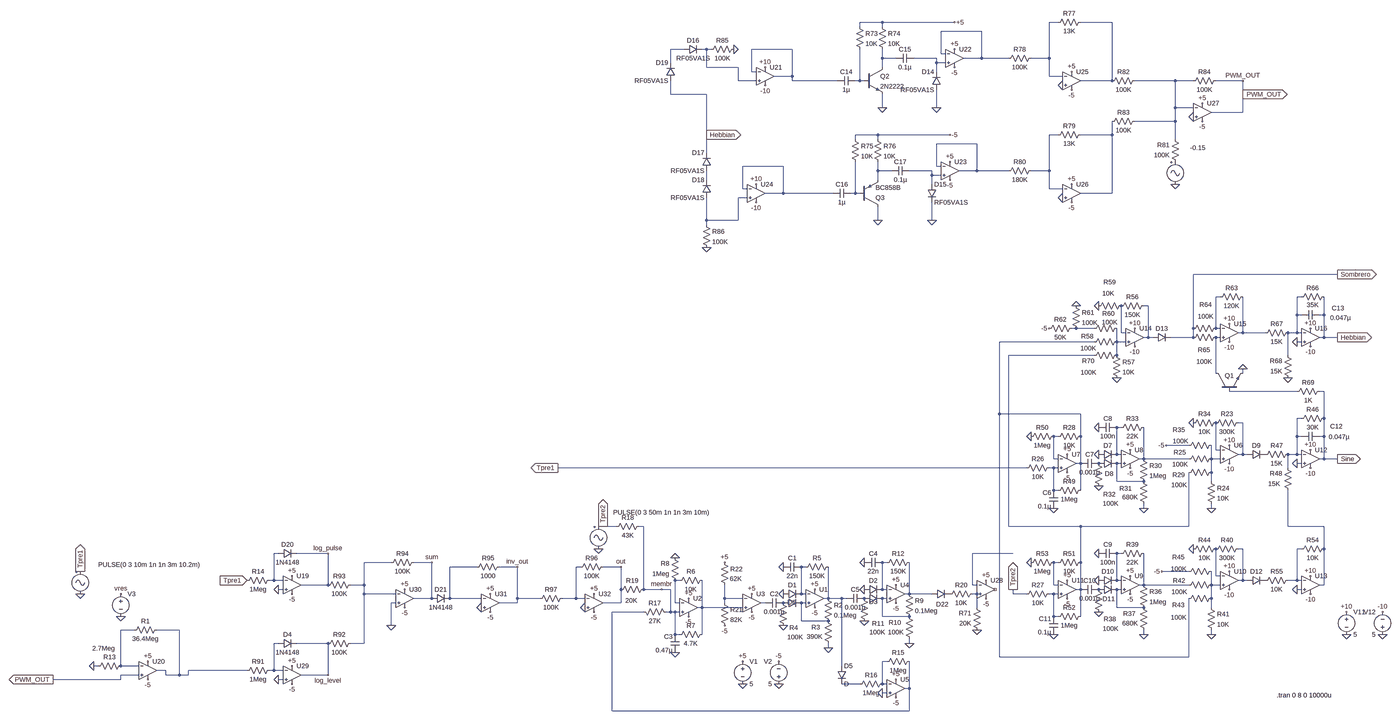
[diagram p0: schematic Lastest_stable-2.asc, whole sheet]
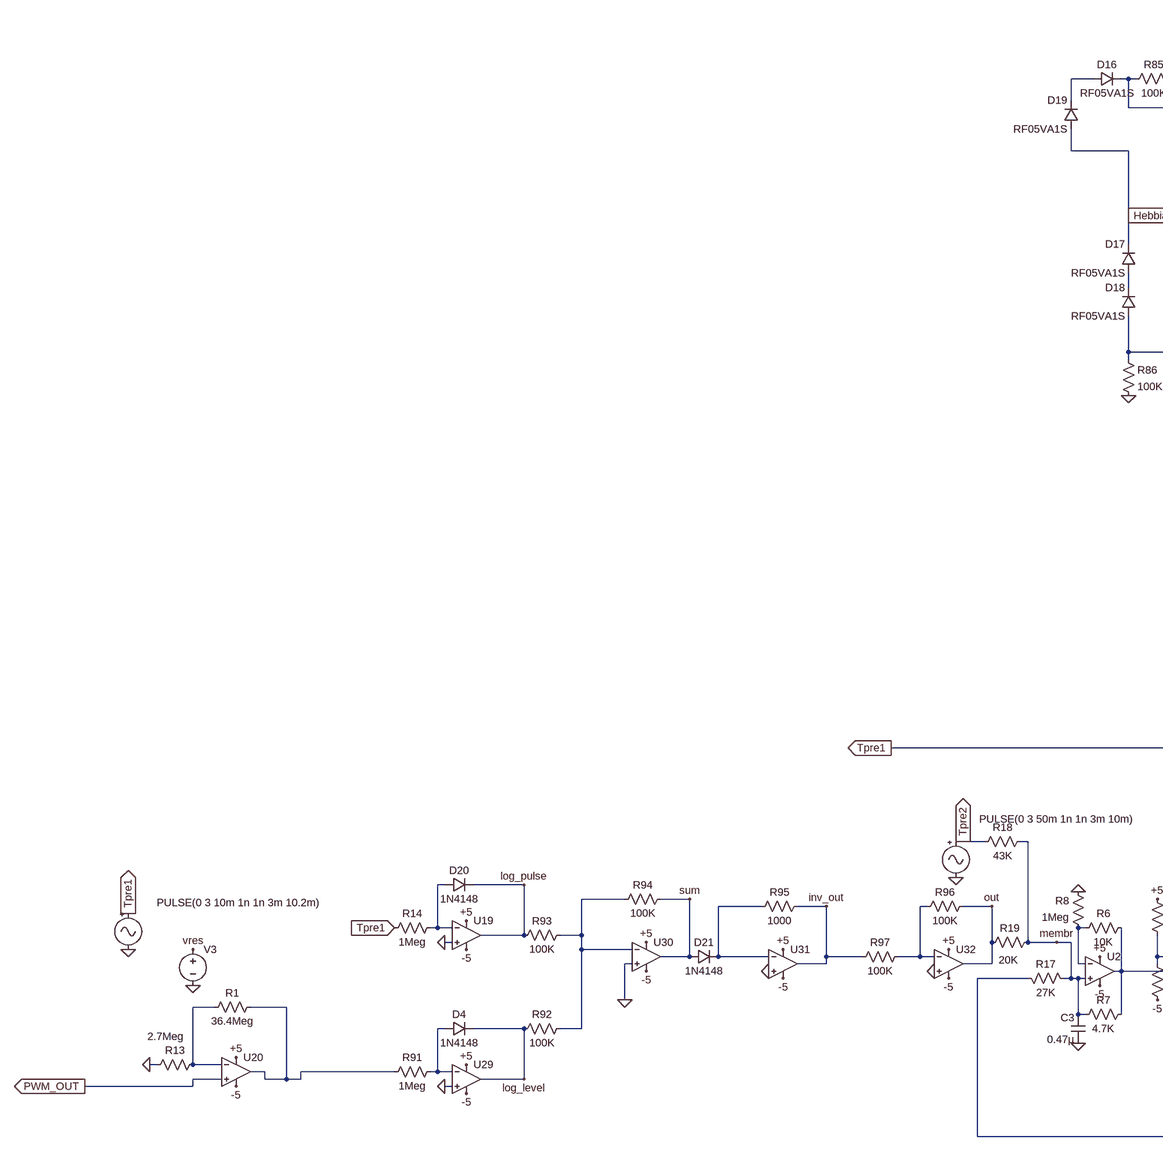
[diagram p1: schematic Lastest_stable-2.asc, part, row 1 of 1, column 1 of 2]
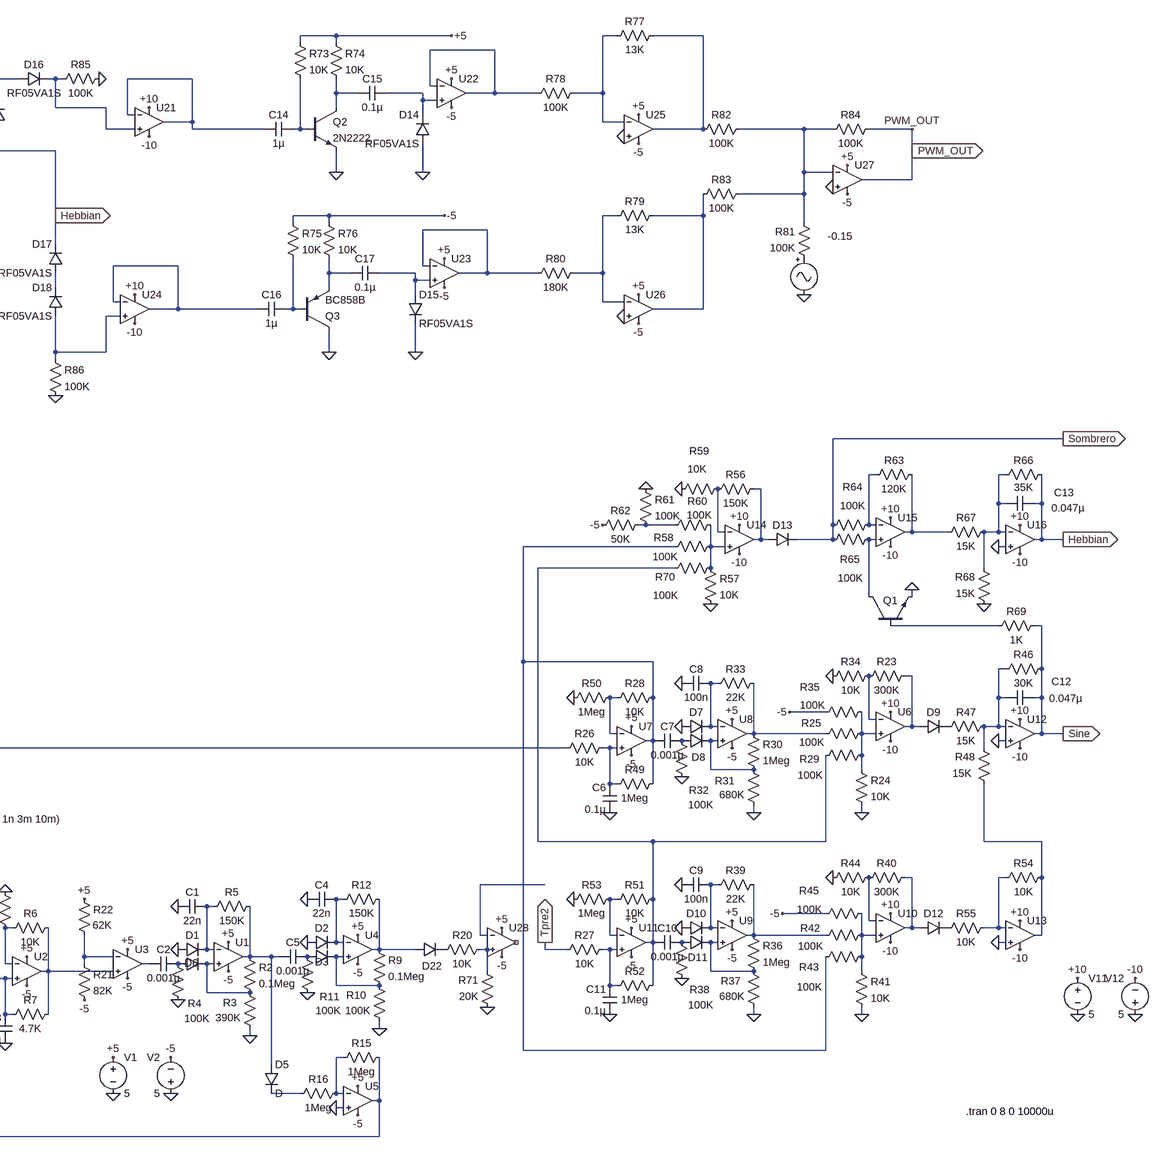
[diagram p2: schematic Lastest_stable-2.asc, part, row 1 of 1, column 2 of 2]
Lastest_stable-2.asc, the LTspice schematic file:
Version 4
SHEET 1 3300 772
WIRE 1488 -1728 1408 -1728
WIRE 1744 -1728 1488 -1728
WIRE 2112 -1728 2080 -1728
WIRE 2304 -1728 2192 -1728
WIRE 1408 -1712 1408 -1728
WIRE 1488 -1712 1488 -1728
WIRE 1840 -1696 1696 -1696
WIRE 784 -1632 736 -1632
WIRE 864 -1632 848 -1632
WIRE 880 -1632 864 -1632
WIRE 1168 -1632 1024 -1632
WIRE 1696 -1616 1696 -1696
WIRE 1712 -1616 1696 -1616
WIRE 1488 -1600 1488 -1632
WIRE 1536 -1600 1488 -1600
WIRE 1680 -1600 1600 -1600
WIRE 1840 -1600 1840 -1696
WIRE 1840 -1600 1776 -1600
WIRE 1936 -1600 1840 -1600
WIRE 2080 -1600 2080 -1728
WIRE 2080 -1600 2016 -1600
WIRE 736 -1584 736 -1632
WIRE 1680 -1584 1680 -1600
WIRE 1712 -1584 1680 -1584
WIRE 864 -1568 864 -1632
WIRE 976 -1568 864 -1568
WIRE 1488 -1568 1488 -1600
WIRE 1024 -1552 1024 -1632
WIRE 1040 -1552 1024 -1552
WIRE 1680 -1552 1680 -1584
WIRE 1168 -1536 1168 -1632
WIRE 1168 -1536 1104 -1536
WIRE 2080 -1536 2080 -1600
WIRE 2128 -1536 2080 -1536
WIRE 976 -1520 976 -1568
WIRE 1040 -1520 976 -1520
WIRE 1168 -1520 1168 -1536
WIRE 1328 -1520 1168 -1520
WIRE 1408 -1520 1408 -1632
WIRE 1408 -1520 1392 -1520
WIRE 1424 -1520 1408 -1520
WIRE 2304 -1520 2304 -1728
WIRE 2304 -1520 2192 -1520
WIRE 2528 -1520 2384 -1520
WIRE 2592 -1520 2528 -1520
WIRE 2768 -1520 2672 -1520
WIRE 736 -1472 736 -1520
WIRE 864 -1472 736 -1472
WIRE 2768 -1472 2768 -1520
WIRE 1488 -1424 1488 -1472
WIRE 1680 -1424 1680 -1488
WIRE 2528 -1424 2528 -1520
WIRE 2592 -1424 2528 -1424
WIRE 2768 -1408 2768 -1472
WIRE 2768 -1408 2656 -1408
WIRE 2528 -1376 2528 -1424
WIRE 2528 -1376 2384 -1376
WIRE 864 -1328 864 -1472
WIRE 1472 -1328 1392 -1328
WIRE 1728 -1328 1472 -1328
WIRE 2112 -1328 2080 -1328
WIRE 2304 -1328 2304 -1376
WIRE 2304 -1328 2192 -1328
WIRE 1392 -1312 1392 -1328
WIRE 1472 -1312 1472 -1328
WIRE 2528 -1312 2528 -1376
WIRE 1824 -1296 1680 -1296
WIRE 864 -1264 864 -1328
WIRE 1136 -1216 992 -1216
WIRE 1680 -1216 1680 -1296
WIRE 1696 -1216 1680 -1216
WIRE 1472 -1200 1472 -1232
WIRE 1520 -1200 1472 -1200
WIRE 1664 -1200 1584 -1200
WIRE 1824 -1200 1824 -1296
WIRE 1824 -1200 1760 -1200
WIRE 1936 -1200 1824 -1200
WIRE 2080 -1200 2080 -1328
WIRE 2080 -1200 2016 -1200
WIRE 1664 -1184 1664 -1200
WIRE 1696 -1184 1664 -1184
WIRE 864 -1168 864 -1200
WIRE 1472 -1168 1472 -1200
WIRE 1664 -1152 1664 -1184
WIRE 992 -1136 992 -1216
WIRE 1008 -1136 992 -1136
WIRE 2080 -1136 2080 -1200
WIRE 2128 -1136 2080 -1136
WIRE 1136 -1120 1136 -1216
WIRE 1136 -1120 1072 -1120
WIRE 1312 -1120 1136 -1120
WIRE 1392 -1120 1392 -1232
WIRE 1392 -1120 1376 -1120
WIRE 1408 -1120 1392 -1120
WIRE 2304 -1120 2304 -1328
WIRE 2304 -1120 2192 -1120
WIRE 1008 -1104 976 -1104
WIRE 864 -1024 864 -1104
WIRE 976 -1024 976 -1104
WIRE 976 -1024 864 -1024
WIRE 1472 -1024 1472 -1072
WIRE 1664 -1024 1664 -1088
WIRE 864 -1008 864 -1024
WIRE 3104 -832 2592 -832
WIRE 2688 -752 2672 -752
WIRE 2976 -752 2960 -752
WIRE 2432 -720 2416 -720
WIRE 2960 -688 2960 -752
WIRE 2976 -688 2960 -688
WIRE 3056 -688 3056 -752
WIRE 3056 -688 3040 -688
WIRE 2176 -640 2160 -640
WIRE 2240 -640 2176 -640
WIRE 2592 -640 2592 -832
WIRE 2672 -640 2672 -752
WIRE 2688 -640 2672 -640
WIRE 2336 -624 2336 -720
WIRE 2352 -624 2336 -624
WIRE 2768 -624 2768 -752
WIRE 2768 -624 2752 -624
WIRE 2848 -624 2768 -624
WIRE 2960 -624 2960 -688
WIRE 2960 -624 2928 -624
WIRE 2976 -624 2960 -624
WIRE 2432 -608 2432 -720
WIRE 2432 -608 2416 -608
WIRE 2448 -608 2432 -608
WIRE 2592 -608 2592 -640
WIRE 2592 -608 2512 -608
WIRE 2688 -608 2672 -608
WIRE 3056 -608 3056 -688
WIRE 3056 -608 3040 -608
WIRE 3104 -608 3056 -608
WIRE 2240 -592 1904 -592
WIRE 2320 -592 2320 -640
WIRE 2352 -592 2320 -592
WIRE 2976 -592 2960 -592
WIRE 2240 -544 1936 -544
WIRE 2320 -544 2320 -592
WIRE 2928 -544 2928 -624
WIRE 2672 -480 2672 -608
WIRE 2768 -480 2768 -496
WIRE 2960 -416 2720 -416
WIRE 3056 -416 3040 -416
WIRE 1904 -336 1904 -592
WIRE 2192 -336 1904 -336
WIRE 2976 -320 2960 -320
WIRE 3056 -320 3056 -416
WIRE 2768 -304 2752 -304
WIRE 2336 -288 2320 -288
WIRE 2112 -256 2096 -256
WIRE 2192 -256 2192 -336
WIRE 2960 -256 2960 -320
WIRE 2976 -256 2960 -256
WIRE 3056 -256 3056 -320
WIRE 3056 -256 3040 -256
WIRE 2576 -224 2496 -224
WIRE 2672 -208 2672 -304
WIRE 2688 -208 2672 -208
WIRE 2320 -192 2320 -288
WIRE 2336 -192 2320 -192
WIRE 2768 -192 2768 -304
WIRE 2768 -192 2752 -192
WIRE 2784 -192 2768 -192
WIRE 2960 -192 2960 -256
WIRE 2960 -192 2928 -192
WIRE 2976 -192 2960 -192
WIRE 2096 -176 2096 -256
WIRE 2112 -176 2096 -176
WIRE 2416 -176 2416 -288
WIRE 2416 -176 2400 -176
WIRE 2576 -176 2416 -176
WIRE 2656 -176 2656 -224
WIRE 2688 -176 2656 -176
WIRE 3056 -176 3056 -256
WIRE 3056 -176 3040 -176
WIRE 3104 -176 3056 -176
WIRE 2192 -160 2192 -256
WIRE 2192 -160 2176 -160
WIRE 2336 -160 2320 -160
WIRE 2976 -160 2960 -160
WIRE 2000 -144 336 -144
WIRE 2096 -144 2080 -144
WIRE 2112 -144 2096 -144
WIRE 2928 -144 2928 -192
WIRE 2656 -128 2656 -176
WIRE 2320 -96 2320 -160
WIRE 2416 -96 2320 -96
WIRE 2656 -96 2656 -128
WIRE 2096 -64 2096 -144
WIRE 2112 -64 2096 -64
WIRE 2192 -64 2192 -160
WIRE 2416 0 2416 -16
WIRE 2656 0 2656 -16
WIRE 496 64 480 64
WIRE 544 64 496 64
WIRE 640 64 624 64
WIRE 1936 64 1936 -544
WIRE 2192 64 1936 64
WIRE 2576 64 2576 -128
WIRE 2576 64 2192 64
WIRE 2928 64 2928 -64
WIRE 3056 64 2928 64
WIRE 2768 144 2752 144
WIRE 2976 144 2960 144
WIRE 3056 144 3056 64
WIRE -656 160 -672 160
WIRE -480 160 -592 160
WIRE 1952 160 1808 160
WIRE 2336 160 2320 160
WIRE -256 192 -352 192
WIRE -112 192 -176 192
WIRE 1504 192 1488 192
WIRE 2112 192 2096 192
WIRE 2192 192 2192 64
WIRE 48 208 -48 208
WIRE 192 208 128 208
WIRE 416 208 400 208
WIRE 560 208 496 208
WIRE 1216 208 1200 208
WIRE 2576 224 2480 224
WIRE 2672 240 2672 144
WIRE 2688 240 2672 240
WIRE -672 256 -672 160
WIRE -672 256 -688 256
WIRE -640 256 -672 256
WIRE 768 256 752 256
WIRE 2320 256 2320 160
WIRE 2336 256 2320 256
WIRE 2768 256 2768 144
WIRE 2768 256 2752 256
WIRE 2784 256 2768 256
WIRE 2960 256 2960 144
WIRE 2960 256 2928 256
WIRE 2976 256 2960 256
WIRE -480 272 -480 160
WIRE -480 272 -576 272
WIRE -352 272 -352 192
WIRE -352 272 -400 272
WIRE 1808 272 1808 160
WIRE 1824 272 1808 272
WIRE 2096 272 2096 192
WIRE 2112 272 2096 272
WIRE 2416 272 2416 160
WIRE 2416 272 2400 272
WIRE 2576 272 2416 272
WIRE 2656 272 2656 224
WIRE 2688 272 2656 272
WIRE 3056 272 3056 144
WIRE 3056 272 3040 272
WIRE -640 288 -656 288
WIRE 560 288 560 208
WIRE 640 288 640 64
WIRE 704 288 640 288
WIRE 736 288 704 288
WIRE 1488 288 1488 192
WIRE 1504 288 1488 288
WIRE 2192 288 2192 192
WIRE 2192 288 2176 288
WIRE 2336 288 2320 288
WIRE 2976 288 2960 288
WIRE -352 304 -352 272
WIRE -240 304 -352 304
WIRE 1200 304 1200 208
WIRE 1216 304 1200 304
WIRE 1584 304 1584 192
WIRE 1584 304 1568 304
WIRE 1664 304 1584 304
WIRE 1824 304 1808 304
WIRE 1952 304 1952 288
WIRE 2000 304 1952 304
WIRE 2096 304 2080 304
WIRE 2112 304 2096 304
WIRE -112 320 -112 192
WIRE -112 320 -176 320
WIRE -48 320 -48 208
WIRE 64 320 -48 320
WIRE 192 320 192 208
WIRE 272 320 192 320
WIRE 400 320 400 208
WIRE 400 320 352 320
WIRE 432 320 400 320
WIRE 928 320 928 272
WIRE 992 320 928 320
WIRE 1296 320 1296 208
WIRE 1296 320 1280 320
WIRE 1344 320 1296 320
WIRE 1360 320 1344 320
WIRE 1504 320 1488 320
WIRE 2656 320 2656 272
WIRE -240 336 -256 336
WIRE 192 336 192 320
WIRE 192 336 128 336
WIRE 560 336 560 288
WIRE 560 336 496 336
WIRE 752 336 752 256
WIRE 768 336 752 336
WIRE 928 336 928 320
WIRE 1072 336 1056 336
WIRE 1216 336 1200 336
WIRE 848 352 848 256
WIRE 848 352 832 352
WIRE 992 352 848 352
WIRE 1824 352 1824 304
WIRE 2320 352 2320 288
WIRE 2416 352 2320 352
WIRE 2656 352 2656 320
WIRE 640 368 528 368
WIRE 736 368 736 288
WIRE 736 368 720 368
WIRE 752 368 736 368
WIRE 768 368 752 368
WIRE 1488 384 1488 320
WIRE 1584 384 1488 384
WIRE 2096 384 2096 304
WIRE 2112 384 2096 384
WIRE 2192 384 2192 288
WIRE 1200 400 1200 336
WIRE 1296 400 1200 400
WIRE -256 416 -256 336
WIRE -1168 432 -1216 432
WIRE -1008 432 -1088 432
WIRE 752 448 752 368
WIRE 768 448 752 448
WIRE 848 448 848 352
WIRE 2416 448 2416 432
WIRE 2656 448 2656 432
WIRE -656 480 -672 480
WIRE -480 480 -592 480
WIRE -352 480 -352 304
WIRE -352 480 -400 480
WIRE 1584 480 1584 464
WIRE 1296 496 1296 480
WIRE 1904 528 1904 -336
WIRE 2576 528 2576 320
WIRE 2576 528 1904 528
WIRE 1504 544 1488 544
WIRE -1296 560 -1312 560
WIRE -1216 560 -1216 432
WIRE -1152 560 -1216 560
WIRE 1344 560 1344 320
WIRE -1056 576 -1088 576
WIRE -768 576 -976 576
WIRE -672 576 -672 480
WIRE -672 576 -688 576
WIRE -640 576 -672 576
WIRE -1152 592 -1216 592
WIRE -1056 592 -1056 576
WIRE -1008 592 -1008 432
WIRE -1008 592 -1056 592
WIRE -976 592 -976 576
WIRE -976 592 -1008 592
WIRE -480 592 -480 480
WIRE -480 592 -576 592
WIRE -1216 608 -1216 592
WIRE -1216 608 -1456 608
WIRE -640 608 -656 608
WIRE 1408 624 1344 624
WIRE 1488 624 1488 544
WIRE 1504 624 1488 624
WIRE 1584 640 1584 544
WIRE 1584 640 1568 640
WIRE 1504 656 1488 656
WIRE 528 720 528 368
WIRE 1584 720 1584 640
WIRE 1584 720 528 720
FLAG 1248 288 +5
FLAG 1248 352 -5
FLAG 1136 304 0
FLAG 1136 208 0
FLAG 1136 416 0
FLAG 1296 496 0
FLAG 800 320 +5
FLAG 800 384 -5
FLAG 752 512 0
FLAG 752 176 0
FLAG 992 624 0
FLAG 1120 624 0
FLAG 1120 544 -5
FLAG 992 544 +5
FLAG 1024 304 +5
FLAG 1024 368 -5
FLAG 1536 272 +5
FLAG 1424 288 0
FLAG 1424 192 0
FLAG 1424 400 0
FLAG 1584 480 0
FLAG 1536 608 +5
FLAG 1536 672 -5
FLAG 1488 656 0
FLAG 704 288 membr
FLAG 928 416 -5
FLAG 928 192 +5
FLAG -1360 304 0
FLAG 480 144 0
FLAG 2144 -192 +5
FLAG 2144 -128 -5
FLAG 2368 -208 +5
FLAG 2368 -144 -5
FLAG 2256 -192 0
FLAG 2256 -288 0
FLAG 2256 -80 0
FLAG 2592 -304 0
FLAG 2496 -224 -5
FLAG 2368 240 +5
FLAG 2368 304 -5
FLAG 2256 256 0
FLAG 2256 160 0
FLAG 2256 368 0
FLAG 2416 448 0
FLAG 2416 0 0
FLAG 2592 144 0
FLAG 2480 224 -5
FLAG 2096 0 0
FLAG 2016 -256 0
FLAG 2144 256 +5
FLAG 2144 320 -5
FLAG 2096 448 0
FLAG 2016 192 0
FLAG 2960 288 0
FLAG 2960 -160 0
FLAG 2656 0 0
FLAG 2656 448 0
FLAG 3104 -176 Sine
IOPIN 3104 -176 Out
FLAG 2256 -720 0
FLAG 2176 -720 0
FLAG 2080 -640 -5
FLAG 2960 -592 0
FLAG 2928 -464 0
FLAG 2768 -496 0
FLAG 3104 -608 Hebbian
IOPIN 3104 -608 Out
FLAG 3104 -832 Sombrero
IOPIN 3104 -832 Out
FLAG 496 64 Tpre2
IOPIN 496 64 Out
FLAG -1360 224 Tpre1
IOPIN -1360 224 Out
FLAG 2320 -464 0
FLAG 3136 448 0
FLAG 3264 448 0
FLAG 3264 368 -10
FLAG 3136 368 +10
FLAG 2720 -224 +10
FLAG 2720 224 +10
FLAG 3008 240 +10
FLAG 3008 -208 +10
FLAG 2720 -160 -10
FLAG 3008 -144 -10
FLAG 2720 288 -10
FLAG 3008 304 -10
FLAG 2384 -576 -10
FLAG 2720 -592 -10
FLAG 3008 -576 -10
FLAG 3008 -640 +10
FLAG 2720 -656 +10
FLAG 2384 -640 +10
FLAG -1120 544 +5
FLAG -1120 608 -5
FLAG 1680 -1424 0
FLAG 1488 -1424 0
FLAG 1744 -1728 +5
FLAG 1744 -1632 +5
FLAG 1744 -1568 -5
FLAG 1664 -1024 0
FLAG 1472 -1024 0
FLAG 1728 -1232 +5
FLAG 1728 -1168 -5
FLAG 1728 -1328 -5
FLAG 2160 -1552 +5
FLAG 2160 -1488 -5
FLAG 2128 -1504 0
FLAG 2160 -1152 +5
FLAG 2160 -1088 -5
FLAG 2128 -1104 0
FLAG 864 -1328 Hebbian
IOPIN 864 -1328 Out
FLAG 1072 -1568 +10
FLAG 1040 -1088 -10
FLAG 2624 -1440 +5
FLAG 2624 -1376 -5
FLAG 2592 -1392 0
FLAG 960 -1632 0
FLAG 864 -928 0
FLAG 1040 -1152 +10
FLAG 1072 -1504 -10
FLAG -1312 560 0
FLAG 2768 -1520 PWM_OUT
FLAG 2768 -1472 PWM_OUT
IOPIN 2768 -1472 Out
FLAG 2528 -1152 0
FLAG -768 256 Tpre1
IOPIN -768 256 In
FLAG 1536 336 -5
FLAG -1216 384 0
FLAG -1216 304 vres
FLAG -608 240 +5
FLAG -608 304 -5
FLAG -656 288 0
FLAG -608 560 +5
FLAG -608 624 -5
FLAG -656 608 0
FLAG -208 288 +5
FLAG -208 352 -5
FLAG -256 416 0
FLAG 96 304 +5
FLAG 96 368 -5
FLAG 64 352 0
FLAG -480 160 log_pulse
FLAG -480 592 log_level
FLAG 192 208 inv_out
FLAG -112 192 sum
FLAG 464 304 +5
FLAG 464 368 -5
FLAG 432 352 0
FLAG 560 208 out
FLAG -1456 608 PWM_OUT
IOPIN -1456 608 Out
FLAG 336 -144 Tpre1
IOPIN 336 -144 Out
FLAG 1824 432 0
FLAG 1856 320 -5
FLAG 1856 256 +5
FLAG 1952 288 Tpre2
IOPIN 1952 288 Out
SYMBOL res -1072 416 R90
WINDOW 0 0 56 VBottom 2
WINDOW 3 32 56 VTop 2
SYMATTR InstName R1
SYMATTR Value 36.4Meg
SYMBOL UniversalOpamp2 1248 320 R0
SYMATTR InstName U1
SYMBOL res 1280 304 R0
SYMATTR InstName R2
SYMATTR Value 0.1Meg
SYMBOL res 1312 496 R180
WINDOW 0 45 74 Left 2
WINDOW 3 36 40 Left 2
SYMATTR InstName R3
SYMATTR Value 390K
SYMBOL res 1120 320 R0
WINDOW 0 38 104 Left 2
WINDOW 3 30 137 Left 2
SYMATTR InstName R4
SYMATTR Value 100K
SYMBOL res 1312 192 R90
WINDOW 0 0 56 VBottom 2
WINDOW 3 32 56 VTop 2
SYMATTR InstName R5
SYMATTR Value 150K
SYMBOL cap 1200 192 R90
WINDOW 0 0 32 VBottom 2
WINDOW 3 32 32 VTop 2
SYMATTR InstName C1
SYMATTR Value 22n
SYMBOL cap 1136 320 R90
WINDOW 0 0 32 VBottom 2
WINDOW 3 32 32 VTop 2
SYMATTR InstName C2
SYMATTR Value 0.001µ
SYMBOL UniversalOpamp2 800 352 R0
SYMATTR InstName U2
SYMBOL cap 768 512 R180
WINDOW 0 24 56 Left 2
WINDOW 3 24 8 Left 2
SYMATTR InstName C3
SYMATTR Value 0.47µ
SYMBOL res 864 240 R90
WINDOW 0 0 56 VBottom 2
WINDOW 3 32 56 VTop 2
SYMATTR InstName R6
SYMATTR Value 10K
SYMBOL res 864 432 R90
WINDOW 0 0 56 VBottom 2
WINDOW 3 32 56 VTop 2
SYMATTR InstName R7
SYMATTR Value 4.7K
SYMBOL res 768 272 R180
WINDOW 0 36 76 Left 2
WINDOW 3 36 40 Left 2
SYMATTR InstName R8
SYMATTR Value 1Meg
SYMBOL voltage 992 528 R0
WINDOW 123 0 0 Left 2
WINDOW 39 0 0 Left 2
SYMATTR InstName V1
SYMATTR Value 5
SYMBOL voltage 1120 640 R180
WINDOW 0 24 96 Left 2
WINDOW 3 24 16 Left 2
WINDOW 123 0 0 Left 2
WINDOW 39 0 0 Left 2
SYMATTR InstName V2
SYMATTR Value 5
SYMBOL UniversalOpamp2 1024 336 R0
SYMATTR InstName U3
SYMBOL UniversalOpamp2 1536 304 R0
SYMATTR InstName U4
SYMBOL diode 1424 304 R270
WINDOW 0 32 32 VTop 2
WINDOW 3 0 32 Invisible 2
SYMATTR InstName D2
SYMATTR Value 1N4148
SYMBOL diode 1424 336 R270
WINDOW 0 -11 32 VTop 2
WINDOW 3 0 32 Invisible 2
SYMATTR InstName D3
SYMATTR Value 1N4148
SYMBOL res 1568 288 R0
SYMATTR InstName R9
SYMATTR Value 0.1Meg
SYMBOL res 1600 480 R180
WINDOW 0 45 74 Left 2
WINDOW 3 36 40 Left 2
SYMATTR InstName R10
SYMATTR Value 100K
SYMBOL res 1408 304 R0
WINDOW 0 43 105 Left 2
WINDOW 3 34 136 Left 2
SYMATTR InstName R11
SYMATTR Value 100K
SYMBOL res 1600 176 R90
WINDOW 0 0 56 VBottom 2
WINDOW 3 32 56 VTop 2
SYMATTR InstName R12
SYMATTR Value 150K
SYMBOL cap 1488 176 R90
WINDOW 0 0 32 VBottom 2
WINDOW 3 32 32 VTop 2
SYMATTR InstName C4
SYMATTR Value 22n
SYMBOL cap 1424 304 R90
WINDOW 0 0 32 VBottom 2
WINDOW 3 32 32 VTop 2
SYMATTR InstName C5
SYMATTR Value 0.001µ
SYMBOL UniversalOpamp2 1536 640 R0
SYMATTR InstName U5
SYMBOL res 1600 528 R90
WINDOW 0 0 56 VBottom 2
WINDOW 3 32 56 VTop 2
SYMATTR InstName R15
SYMATTR Value 1Meg
SYMBOL res 1392 640 R270
WINDOW 0 32 56 VTop 2
WINDOW 3 0 56 VBottom 2
SYMATTR InstName R16
SYMATTR Value 1Meg
SYMBOL diode 1328 560 R0
SYMATTR InstName D5
SYMBOL res 624 352 M90
WINDOW 0 0 56 VBottom 2
WINDOW 3 32 56 VTop 2
SYMATTR InstName R17
SYMATTR Value 27K
SYMBOL res 912 320 R0
SYMATTR InstName R21
SYMATTR Value 82K
SYMBOL res 912 176 R0
WINDOW 3 34 74 Left 2
SYMATTR Value 62K
SYMATTR InstName R22
SYMBOL UniversalOpamp2 2720 -192 R0
SYMATTR InstName U6
SYMBOL res 2768 -320 R90
WINDOW 0 0 56 VBottom 2
WINDOW 3 32 56 VTop 2
SYMATTR InstName R23
SYMATTR Value 300K
SYMBOL res 2640 -112 R0
SYMATTR InstName R24
SYMATTR Value 10K
SYMBOL res 2672 -192 R90
WINDOW 0 8 128 VBottom 2
WINDOW 3 20 127 VTop 2
SYMATTR InstName R25
SYMATTR Value 100K
SYMBOL UniversalOpamp2 2144 -160 R0
SYMATTR InstName U7
SYMBOL cap 2112 0 R180
WINDOW 0 24 56 Left 2
WINDOW 3 24 8 Left 2
SYMATTR InstName C6
SYMATTR Value 0.1µ
SYMBOL res 2096 -160 R90
WINDOW 0 0 56 VBottom 2
WINDOW 3 32 56 VTop 2
SYMATTR InstName R26
SYMATTR Value 10K
SYMBOL res 2096 288 R90
WINDOW 0 0 56 VBottom 2
WINDOW 3 32 56 VTop 2
SYMATTR InstName R27
SYMATTR Value 10K
SYMBOL res 2208 -272 R90
WINDOW 0 0 56 VBottom 2
WINDOW 3 32 56 VTop 2
SYMATTR InstName R28
SYMATTR Value 10K
SYMBOL res 2672 -144 R90
WINDOW 0 40 132 VBottom 2
WINDOW 3 45 130 VTop 2
SYMATTR InstName R29
SYMATTR Value 100K
SYMBOL UniversalOpamp2 2368 -176 R0
SYMATTR InstName U8
SYMBOL diode 2256 -176 R270
WINDOW 0 32 32 VTop 2
WINDOW 3 0 32 Invisible 2
SYMATTR InstName D7
SYMBOL diode 2256 -144 R270
WINDOW 0 -36 37 VTop 2
WINDOW 3 0 32 Invisible 2
SYMATTR InstName D8
SYMBOL res 2400 -192 R0
SYMATTR InstName R30
SYMATTR Value 1Meg
SYMBOL res 2432 0 R180
WINDOW 0 58 71 Left 2
WINDOW 3 36 40 Left 2
SYMATTR InstName R31
SYMATTR Value 680K
SYMBOL res 2240 -176 R0
WINDOW 0 32 126 Left 2
WINDOW 3 30 158 Left 2
SYMATTR InstName R32
SYMATTR Value 100K
SYMBOL cap 2256 -176 R90
WINDOW 0 0 32 VBottom 2
WINDOW 3 32 32 VTop 2
SYMATTR InstName C7
SYMATTR Value 0.001µ
SYMBOL res 2432 -304 R90
WINDOW 0 0 56 VBottom 2
WINDOW 3 32 56 VTop 2
SYMATTR InstName R33
SYMATTR Value 22K
SYMBOL cap 2320 -304 R90
WINDOW 0 0 32 VBottom 2
WINDOW 3 32 32 VTop 2
SYMATTR InstName C8
SYMATTR Value 100n
SYMBOL res 2576 -288 R270
WINDOW 0 32 56 VTop 2
WINDOW 3 0 56 VBottom 2
SYMATTR InstName R34
SYMATTR Value 10K
SYMBOL diode 2784 -176 R270
WINDOW 0 32 32 VTop 2
WINDOW 3 0 32 Invisible 2
SYMATTR InstName D9
SYMBOL res 2672 -240 R90
WINDOW 0 -24 131 VBottom 2
WINDOW 3 -15 125 VTop 2
SYMATTR InstName R35
SYMATTR Value 100K
SYMBOL UniversalOpamp2 2368 272 R0
SYMATTR InstName U9
SYMBOL diode 2256 272 R270
WINDOW 0 32 32 VTop 2
WINDOW 3 0 32 Invisible 2
SYMATTR InstName D10
SYMBOL diode 2256 304 R270
WINDOW 0 -33 36 VTop 2
WINDOW 3 0 32 Invisible 2
SYMATTR InstName D11
SYMBOL res 2400 256 R0
SYMATTR InstName R36
SYMATTR Value 1Meg
SYMBOL res 2432 448 R180
WINDOW 0 45 74 Left 2
WINDOW 3 36 40 Left 2
SYMATTR InstName R37
SYMATTR Value 680K
SYMBOL res 2240 272 R0
WINDOW 0 34 121 Left 2
WINDOW 3 30 155 Left 2
SYMATTR InstName R38
SYMATTR Value 100K
SYMBOL res 2432 144 R90
WINDOW 0 0 56 VBottom 2
WINDOW 3 32 56 VTop 2
SYMATTR InstName R39
SYMATTR Value 22K
SYMBOL cap 2320 144 R90
WINDOW 0 0 32 VBottom 2
WINDOW 3 32 32 VTop 2
SYMATTR InstName C9
SYMATTR Value 100n
SYMBOL cap 2256 272 R90
WINDOW 0 0 32 VBottom 2
WINDOW 3 32 32 VTop 2
SYMATTR InstName C10
SYMATTR Value 0.001µ
SYMBOL UniversalOpamp2 2720 256 R0
SYMATTR InstName U10
SYMBOL res 2768 128 R90
WINDOW 0 0 56 VBottom 2
WINDOW 3 32 56 VTop 2
SYMATTR InstName R40
SYMATTR Value 300K
SYMBOL res 2640 336 R0
SYMATTR InstName R41
SYMATTR Value 10K
SYMBOL res 2672 256 R90
WINDOW 0 16 130 VBottom 2
WINDOW 3 25 129 VTop 2
SYMATTR InstName R42
SYMATTR Value 100K
SYMBOL res 2672 304 R90
WINDOW 0 55 133 VBottom 2
WINDOW 3 68 132 VTop 2
SYMATTR InstName R43
SYMATTR Value 100K
SYMBOL res 2576 160 R270
WINDOW 0 32 56 VTop 2
WINDOW 3 0 56 VBottom 2
SYMATTR InstName R44
SYMATTR Value 10K
SYMBOL diode 2784 272 R270
WINDOW 0 32 32 VTop 2
WINDOW 3 0 32 Invisible 2
SYMATTR InstName D12
SYMBOL res 2672 208 R90
WINDOW 0 -19 133 VBottom 2
WINDOW 3 -9 132 VTop 2
SYMATTR InstName R45
SYMATTR Value 100K
SYMBOL res 3072 -336 R90
WINDOW 0 0 56 VBottom 2
WINDOW 3 32 56 VTop 2
SYMATTR InstName R46
SYMATTR Value 30K
SYMBOL res 2944 -208 R90
WINDOW 0 0 56 VBottom 2
WINDOW 3 32 56 VTop 2
SYMATTR InstName R47
SYMATTR Value 15K
SYMBOL res 2944 -48 R180
WINDOW 0 36 76 Left 2
WINDOW 3 43 40 Left 2
SYMATTR InstName R48
SYMATTR Value 15K
SYMBOL res 2208 -80 R90
WINDOW 0 0 56 VBottom 2
WINDOW 3 32 56 VTop 2
SYMATTR InstName R49
SYMATTR Value 1Meg
SYMBOL res 2112 -272 R90
WINDOW 0 0 56 VBottom 2
WINDOW 3 32 56 VTop 2
SYMATTR InstName R50
SYMATTR Value 1Meg
SYMBOL UniversalOpamp2 2144 288 R0
SYMATTR InstName U11
SYMBOL cap 2112 448 R180
WINDOW 0 24 56 Left 2
WINDOW 3 24 8 Left 2
SYMATTR InstName C11
SYMATTR Value 0.1µ
SYMBOL res 2208 176 R90
WINDOW 0 0 56 VBottom 2
WINDOW 3 32 56 VTop 2
SYMATTR InstName R51
SYMATTR Value 10K
SYMBOL res 2208 368 R90
WINDOW 0 0 56 VBottom 2
WINDOW 3 32 56 VTop 2
SYMATTR InstName R52
SYMATTR Value 1Meg
SYMBOL res 2112 176 R90
WINDOW 0 0 56 VBottom 2
WINDOW 3 32 56 VTop 2
SYMATTR InstName R53
SYMATTR Value 1Meg
SYMBOL UniversalOpamp2 3008 -176 R0
SYMATTR InstName U12
SYMBOL res 3072 128 R90
WINDOW 0 0 56 VBottom 2
WINDOW 3 32 56 VTop 2
SYMATTR InstName R54
SYMATTR Value 10K
SYMBOL UniversalOpamp2 3008 272 R0
SYMATTR InstName U13
SYMBOL res 2944 240 R90
WINDOW 0 0 56 VBottom 2
WINDOW 3 32 56 VTop 2
SYMATTR InstName R55
SYMATTR Value 10K
SYMBOL cap 3040 -272 R90
WINDOW 0 -4 -60 VBottom 2
WINDOW 3 2 -70 VTop 2
SYMATTR InstName C12
SYMATTR Value 0.047µ
SYMBOL UniversalOpamp2 2384 -608 R0
SYMATTR InstName U14
SYMBOL res 2432 -736 R90
WINDOW 0 0 56 VBottom 2
WINDOW 3 32 56 VTop 2
SYMATTR InstName R56
SYMATTR Value 150K
SYMBOL res 2304 -560 R0
SYMATTR InstName R57
SYMATTR Value 10K
SYMBOL res 2336 -608 R90
WINDOW 0 12 120 VBottom 2
WINDOW 3 23 117 VTop 2
SYMATTR InstName R58
SYMATTR Value 100K
SYMBOL res 2240 -704 R270
WINDOW 0 85 55 VTop 2
WINDOW 3 76 50 VBottom 2
SYMATTR InstName R59
SYMATTR Value 10K
SYMBOL res 2336 -656 R90
WINDOW 0 -21 45 VBottom 2
WINDOW 3 -21 41 VTop 2
SYMATTR InstName R60
SYMATTR Value 100K
SYMBOL res 2160 -736 R0
SYMATTR InstName R61
SYMATTR Value 100K
SYMBOL res 2176 -656 R90
WINDOW 0 0 56 VBottom 2
WINDOW 3 32 56 VTop 2
SYMATTR InstName R62
SYMATTR Value 50K
SYMBOL diode 2448 -592 R270
WINDOW 0 32 32 VTop 2
WINDOW 3 0 32 Invisible 2
SYMATTR InstName D13
SYMBOL res 2784 -768 R90
WINDOW 0 0 56 VBottom 2
WINDOW 3 32 56 VTop 2
SYMATTR InstName R63
SYMATTR Value 120K
SYMBOL UniversalOpamp2 2720 -624 R0
SYMATTR InstName U15
SYMBOL res 2688 -656 R90
WINDOW 0 -53 52 VBottom 2
WINDOW 3 -42 52 VTop 2
SYMATTR InstName R64
SYMATTR Value 100K
SYMBOL res 2688 -624 R90
WINDOW 0 76 58 VBottom 2
WINDOW 3 87 57 VTop 2
SYMATTR InstName R65
SYMATTR Value 100K
SYMBOL npn 2672 -416 R270
WINDOW 0 56 32 VRight 2
WINDOW 3 56 68 Invisible 2
SYMATTR InstName Q1
SYMBOL res 3072 -768 R90
WINDOW 0 0 56 VBottom 2
WINDOW 3 60 56 VBottom 2
SYMATTR InstName R66
SYMATTR Value 35K
SYMBOL res 2944 -640 R90
WINDOW 0 0 56 VBottom 2
WINDOW 3 32 56 VTop 2
SYMATTR InstName R67
SYMATTR Value 15K
SYMBOL res 2944 -448 R180
WINDOW 0 36 76 Left 2
WINDOW 3 36 40 Left 2
SYMATTR InstName R68
SYMATTR Value 15K
SYMBOL UniversalOpamp2 3008 -608 R0
SYMATTR InstName U16
SYMBOL cap 3040 -704 R90
WINDOW 0 8 -66 VBottom 2
WINDOW 3 11 -75 VTop 2
SYMATTR InstName C13
SYMATTR Value 0.047µ
SYMBOL res 2944 -400 R270
WINDOW 0 32 56 VTop 2
WINDOW 3 0 56 VBottom 2
SYMATTR InstName R69
SYMATTR Value 1K
SYMBOL signal 480 48 R0
WINDOW 0 24 16 Invisible 2
WINDOW 3 52 -34 Left 2
WINDOW 123 0 0 Left 2
WINDOW 39 0 0 Left 2
SYMATTR InstName V9
SYMATTR Value PULSE(0 3 50m 1n 1n 3m 10m)
SYMBOL signal -1360 208 R0
WINDOW 0 24 16 Invisible 2
WINDOW 3 64 -8 Left 2
WINDOW 123 0 0 Left 2
WINDOW 39 0 0 Left 2
SYMATTR InstName V10
SYMATTR Value PULSE(0 3 10m 1n 1n 3m 10.2m)
SYMBOL res 2336 -560 R90
WINDOW 0 51 117 VBottom 2
WINDOW 3 61 116 VTop 2
SYMATTR InstName R70
SYMATTR Value 100K
SYMBOL voltage 3136 352 R0
WINDOW 123 0 0 Left 2
WINDOW 39 0 0 Left 2
SYMATTR InstName V11
SYMATTR Value 5
SYMBOL voltage 3264 464 R180
WINDOW 0 24 96 Left 2
WINDOW 3 24 16 Left 2
WINDOW 123 0 0 Left 2
WINDOW 39 0 0 Left 2
SYMATTR InstName V12
SYMATTR Value 5
SYMBOL diode 1136 320 R270
WINDOW 0 32 32 VTop 2
WINDOW 3 0 32 Invisible 2
SYMATTR InstName D1
SYMATTR Value 1N4148
SYMBOL diode 1136 352 R270
WINDOW 0 2 30 VTop 2
WINDOW 3 0 32 Invisible 2
SYMATTR InstName D6
SYMATTR Value 1N4148
SYMBOL UniversalOpamp2 -1120 576 R0
SYMATTR InstName U20
SYMATTR SpiceLine2 en=0 enk=0 in=0 ink=0 Rin=5000Meg
SYMBOL cap 1392 -1536 R90
WINDOW 0 0 32 VBottom 2
WINDOW 3 32 32 VTop 2
SYMATTR InstName C14
SYMATTR Value 1µ
SYMBOL res 1392 -1728 R0
SYMATTR InstName R73
SYMATTR Value 10K
SYMBOL res 1472 -1728 R0
SYMATTR InstName R74
SYMATTR Value 10K
SYMBOL npn 1424 -1568 R0
SYMATTR InstName Q2
SYMATTR Value 2N2222
SYMBOL cap 1600 -1616 R90
WINDOW 0 0 32 VBottom 2
WINDOW 3 32 32 VTop 2
SYMATTR InstName C15
SYMATTR Value 0.1µ
SYMBOL diode 1696 -1488 R180
WINDOW 0 24 64 Left 2
WINDOW 3 24 0 Left 2
SYMATTR InstName D14
SYMATTR Value RF05VA1S
SYMBOL UniversalOpamp2 1072 -1536 R0
SYMATTR InstName U21
SYMBOL UniversalOpamp2 1744 -1600 R0
SYMATTR InstName U22
SYMBOL cap 1376 -1136 R90
WINDOW 0 0 32 VBottom 2
WINDOW 3 32 32 VTop 2
SYMATTR InstName C16
SYMATTR Value 1µ
SYMBOL res 1376 -1328 R0
SYMATTR InstName R75
SYMATTR Value 10K
SYMBOL res 1456 -1328 R0
SYMATTR InstName R76
SYMATTR Value 10K
SYMBOL cap 1584 -1216 R90
WINDOW 0 0 32 VBottom 2
WINDOW 3 32 32 VTop 2
SYMATTR InstName C17
SYMATTR Value 0.1µ
SYMBOL diode 1648 -1152 R0
SYMATTR InstName D15
SYMATTR Value RF05VA1S
SYMBOL UniversalOpamp2 1728 -1200 R0
SYMATTR InstName U23
SYMBOL pnp 1408 -1072 M180
SYMATTR InstName Q3
SYMATTR Value BC858B
SYMBOL UniversalOpamp2 1040 -1120 R0
SYMATTR InstName U24
SYMBOL UniversalOpamp2 2160 -1520 R0
SYMATTR InstName U25
SYMBOL res 2208 -1744 R90
WINDOW 0 0 56 VBottom 2
WINDOW 3 32 56 VTop 2
SYMATTR InstName R77
SYMATTR Value 13K
SYMBOL res 2032 -1616 R90
WINDOW 0 0 56 VBottom 2
WINDOW 3 32 56 VTop 2
SYMATTR InstName R78
SYMATTR Value 100K
SYMBOL UniversalOpamp2 2160 -1120 R0
SYMATTR InstName U26
SYMBOL res 2208 -1344 R90
WINDOW 0 0 56 VBottom 2
WINDOW 3 32 56 VTop 2
SYMATTR InstName R79
SYMATTR Value 13K
SYMBOL res 2032 -1216 R90
WINDOW 0 0 56 VBottom 2
WINDOW 3 32 56 VTop 2
SYMATTR InstName R80
SYMATTR Value 180K
SYMBOL UniversalOpamp2 2624 -1408 R0
SYMATTR InstName U27
SYMBOL res 2400 -1536 R90
WINDOW 0 0 56 VBottom 2
WINDOW 3 32 56 VTop 2
SYMATTR InstName R82
SYMATTR Value 100K
SYMBOL res 2400 -1392 R90
WINDOW 0 0 56 VBottom 2
WINDOW 3 32 56 VTop 2
SYMATTR InstName R83
SYMATTR Value 100K
SYMBOL res 2688 -1536 R90
WINDOW 0 0 56 VBottom 2
WINDOW 3 32 56 VTop 2
SYMATTR InstName R84
SYMATTR Value 100K
SYMBOL diode 784 -1616 R270
WINDOW 0 32 32 VTop 2
WINDOW 3 0 32 VBottom 2
SYMATTR InstName D16
SYMATTR Value RF05VA1S
SYMBOL diode 880 -1200 R180
WINDOW 0 24 64 Left 2
WINDOW 3 24 0 Left 2
SYMATTR InstName D17
SYMATTR Value RF05VA1S
SYMBOL res 976 -1648 R90
WINDOW 0 0 56 VBottom 2
WINDOW 3 32 56 VTop 2
SYMATTR InstName R85
SYMATTR Value 100K
SYMBOL res 848 -1024 R0
SYMATTR InstName R86
SYMATTR Value 100K
SYMBOL diode 880 -1104 R180
WINDOW 0 24 64 Left 2
WINDOW 3 24 0 Left 2
SYMATTR InstName D18
SYMATTR Value RF05VA1S
SYMBOL diode 752 -1520 R180
WINDOW 0 24 64 Left 2
WINDOW 3 24 0 Left 2
SYMATTR InstName D19
SYMATTR Value RF05VA1S
SYMBOL res 2544 -1216 R180
WINDOW 0 36 76 Left 2
WINDOW 3 36 40 Left 2
SYMATTR InstName R81
SYMATTR Value 100K
SYMBOL signal 2528 -1248 R0
WINDOW 0 24 16 Invisible 2
WINDOW 3 52 -34 Left 2
WINDOW 123 0 0 Left 2
WINDOW 39 0 0 Left 2
SYMATTR InstName V7
SYMATTR Value -0.15
SYMBOL res -1200 544 R90
WINDOW 0 0 56 VBottom 2
WINDOW 3 -62 77 VTop 2
SYMATTR InstName R13
SYMATTR Value 2.7Meg
SYMBOL UniversalOpamp2 1856 288 R0
SYMATTR InstName U28
SYMBOL voltage -1216 288 R0
WINDOW 123 0 0 Left 2
WINDOW 39 0 0 Left 2
SYMATTR InstName V3
SYMATTR Value ""
SYMBOL UniversalOpamp2 -608 272 R0
SYMATTR InstName U19
SYMBOL res -672 240 R90
WINDOW 0 0 56 VBottom 2
WINDOW 3 32 56 VTop 2
SYMATTR InstName R14
SYMATTR Value 1Meg
SYMBOL UniversalOpamp2 -608 592 R0
SYMATTR InstName U29
SYMBOL res -672 560 R90
WINDOW 0 0 56 VBottom 2
WINDOW 3 32 56 VTop 2
SYMATTR InstName R91
SYMATTR Value 1Meg
SYMBOL UniversalOpamp2 -208 320 R0
SYMATTR InstName U30
SYMBOL res -384 464 R90
WINDOW 0 0 56 VBottom 2
WINDOW 3 32 56 VTop 2
SYMATTR InstName R92
SYMATTR Value 100K
SYMBOL res -384 256 R90
WINDOW 0 0 56 VBottom 2
WINDOW 3 32 56 VTop 2
SYMATTR InstName R93
SYMATTR Value 100K
SYMBOL res -160 176 R90
WINDOW 0 0 56 VBottom 2
WINDOW 3 32 56 VTop 2
SYMATTR InstName R94
SYMATTR Value 100K
SYMBOL res 144 192 R90
WINDOW 0 0 56 VBottom 2
WINDOW 3 32 56 VTop 2
SYMATTR InstName R95
SYMATTR Value 1000
SYMBOL UniversalOpamp2 96 336 R0
SYMATTR InstName U31
SYMBOL diode -656 496 R270
WINDOW 0 32 32 VTop 2
WINDOW 3 0 32 VBottom 2
SYMATTR InstName D4
SYMATTR Value 1N4148
SYMBOL diode -656 176 R270
WINDOW 0 32 32 VTop 2
WINDOW 3 0 32 VBottom 2
SYMATTR InstName D20
SYMATTR Value 1N4148
SYMBOL diode -112 336 R270
WINDOW 0 32 32 VTop 2
WINDOW 3 0 32 VBottom 2
SYMATTR InstName D21
SYMATTR Value 1N4148
SYMBOL res 512 192 R90
WINDOW 0 0 56 VBottom 2
WINDOW 3 32 56 VTop 2
SYMATTR InstName R96
SYMATTR Value 100K
SYMBOL UniversalOpamp2 464 336 R0
SYMATTR InstName U32
SYMBOL res 368 304 R90
WINDOW 0 0 56 VBottom 2
WINDOW 3 32 56 VTop 2
SYMATTR InstName R97
SYMATTR Value 100K
SYMBOL res 1824 288 R90
WINDOW 0 0 56 VBottom 2
WINDOW 3 32 56 VTop 2
SYMATTR InstName R20
SYMATTR Value 10K
SYMBOL res 1840 448 R180
WINDOW 0 36 76 Left 2
WINDOW 3 36 40 Left 2
SYMATTR InstName R71
SYMATTR Value 20K
SYMBOL diode 1664 320 R270
WINDOW 0 -36 37 VTop 2
WINDOW 3 0 32 Invisible 2
SYMATTR InstName D22
SYMATTR Value 1N4148
SYMBOL res 656 272 R90
WINDOW 0 0 56 VBottom 2
WINDOW 3 40 59 VTop 2
SYMATTR InstName R19
SYMATTR Value 20K
SYMBOL res 640 48 R90
WINDOW 0 0 56 VBottom 2
WINDOW 3 32 56 VTop 2
SYMATTR InstName R18
SYMATTR Value 43K
TEXT 2888 664 Left 2 !.tran 0 8 0 10000u

The netlist it stands for:
* Lastest_stable-2.asc
R1 N068 N067 36.4Meg
XU1 N064 N051 +5 -5 N061 level.2 Avol=1Meg GBW=10Meg Slew=10Meg ilimit=25m rail=0 Vos=0 phimargin=45 en=0 enk=0 in=0 ink=0 Rin=500Meg  ; pins IN+ IN- V+ V- OUT
R2 N061 N064 0.1Meg
R3 0 N064 390K
R4 P001 0 100K
R5 N061 N051 150K
C1 N051 0 22n
C2 P001 N063 0.001µ
XU2 membr N053 +5 -5 N065 level.2 Avol=1Meg GBW=10Meg Slew=10Meg ilimit=25m rail=0 Vos=0 phimargin=45 en=0 enk=0 in=0 ink=0 Rin=500Meg  ; pins IN+ IN- V+ V- OUT
C3 0 membr 0.47µ
R6 N065 N053 10K
R7 N065 membr 4.7K
R8 N053 0 1Meg
V1 +5 0 5
V2 0 -5 5
XU3 N065 N060 +5 -5 N063 level.2 Avol=1Meg GBW=10Meg Slew=10Meg ilimit=25m rail=0 Vos=0 phimargin=45 en=0 enk=0 in=0 ink=0 Rin=500Meg  ; pins IN+ IN- V+ V- OUT
XU4 N062 N047 +5 -5 N057 level.2 Avol=1Meg GBW=10Meg Slew=10Meg ilimit=25m rail=0 Vos=0 phimargin=45 en=0 enk=0 in=0 ink=0 Rin=500Meg  ; pins IN+ IN- V+ V- OUT
D2 0 N047 1N4148
D3 P002 N062 1N4148
R9 N057 N062 0.1Meg
R10 0 N062 100K
R11 P002 0 100K
R12 N057 N047 150K
C4 N047 0 22n
C5 P002 N061 0.001µ
XU5 0 N070 +5 -5 N066 level.2 Avol=1Meg GBW=10Meg Slew=10Meg ilimit=25m rail=0 Vos=0 phimargin=45 en=0 enk=0 in=0 ink=0 Rin=500Meg  ; pins IN+ IN- V+ V- OUT
R15 N066 N070 1Meg
R16 N071 N070 1Meg
D5 N061 N071 D
R17 N066 membr 27K
R21 N060 -5 82K
R22 +5 N060 62K
XU6 N037 N035 +10 -10 N032 level.2 Avol=1Meg GBW=10Meg Slew=10Meg ilimit=25m rail=0 Vos=0 phimargin=45 en=0 enk=0 in=0 ink=0 Rin=500Meg  ; pins IN+ IN- V+ V- OUT
R23 N032 N035 300K
R24 N037 0 10K
R25 N037 N036 100K
XU7 N039 N034 +5 -5 N027 level.2 Avol=1Meg GBW=10Meg Slew=10Meg ilimit=25m rail=0 Vos=0 phimargin=45 en=0 enk=0 in=0 ink=0 Rin=500Meg  ; pins IN+ IN- V+ V- OUT
C6 0 N039 0.1µ
R26 N039 Tpre1 10K
R27 N059 Tpre2 10K
R28 N027 N034 10K
R29 N037 N029 100K
XU8 N038 N033 +5 -5 N036 level.2 Avol=1Meg GBW=10Meg Slew=10Meg ilimit=25m rail=0 Vos=0 phimargin=45 en=0 enk=0 in=0 ink=0 Rin=500Meg  ; pins IN+ IN- V+ V- OUT
D7 0 N033 D
D8 P003 N038 D
R30 N036 N038 1Meg
R31 0 N038 680K
R32 P003 0 100K
C7 P003 N027 0.001µ
R33 N036 N033 22K
C8 N033 0 100n
R34 0 N035 10K
D9 N032 P004 D
R35 N037 -5 100K
XU9 N056 N045 +5 -5 N054 level.2 Avol=1Meg GBW=10Meg Slew=10Meg ilimit=25m rail=0 Vos=0 phimargin=45 en=0 enk=0 in=0 ink=0 Rin=500Meg  ; pins IN+ IN- V+ V- OUT
D10 0 N045 D
D11 P005 N056 D
R36 N054 N056 1Meg
R37 0 N056 680K
R38 P005 0 100K
R39 N054 N045 22K
C9 N045 0 100n
C10 P005 N029 0.001µ
XU10 N055 N052 +10 -10 N041 level.2 Avol=1Meg GBW=10Meg Slew=10Meg ilimit=25m rail=0 Vos=0 phimargin=45 en=0 enk=0 in=0 ink=0 Rin=500Meg  ; pins IN+ IN- V+ V- OUT
R40 N041 N052 300K
R41 N055 0 10K
R42 N055 N054 100K
R43 N055 N027 100K
R44 0 N052 10K
D12 N041 P006 D
R45 N055 -5 100K
R46 Sine N031 30K
R47 N031 P004 15K
R48 N040 N031 15K
R49 N027 N039 1Meg
R50 N034 0 1Meg
XU11 N059 N048 +5 -5 N029 level.2 Avol=1Meg GBW=10Meg Slew=10Meg ilimit=25m rail=0 Vos=0 phimargin=45 en=0 enk=0 in=0 ink=0 Rin=500Meg  ; pins IN+ IN- V+ V- OUT
C11 0 N059 0.1µ
R51 N029 N048 10K
R52 N029 N059 1Meg
R53 N048 0 1Meg
XU12 0 N031 +10 -10 Sine level.2 Avol=1Meg GBW=10Meg Slew=10Meg ilimit=25m rail=0 Vos=0 phimargin=45 en=0 enk=0 in=0 ink=0 Rin=500Meg  ; pins IN+ IN- V+ V- OUT
R54 N040 N042 10K
XU13 0 N042 +10 -10 N040 level.2 Avol=1Meg GBW=10Meg Slew=10Meg ilimit=25m rail=0 Vos=0 phimargin=45 en=0 enk=0 in=0 ink=0 Rin=500Meg  ; pins IN+ IN- V+ V- OUT
R55 N042 P006 10K
C12 Sine N031 0.047µ
XU14 N028 N024 +10 -10 N022 level.2 Avol=1Meg GBW=10Meg Slew=10Meg ilimit=25m rail=0 Vos=0 phimargin=45 en=0 enk=0 in=0 ink=0 Rin=500Meg  ; pins IN+ IN- V+ V- OUT
R56 N022 N024 150K
R57 N028 0 10K
R58 N028 N027 100K
R59 0 N024 10K
R60 N028 N023 100K
R61 0 N023 100K
R62 N023 -5 50K
D13 N022 Sombrero D
R63 N025 N020 120K
XU15 N026 N020 +10 -10 N025 level.2 Avol=1Meg GBW=10Meg Slew=10Meg ilimit=25m rail=0 Vos=0 phimargin=45 en=0 enk=0 in=0 ink=0 Rin=500Meg  ; pins IN+ IN- V+ V- OUT
R64 N020 Sombrero 100K
R65 N026 Sombrero 100K
Q1 N026 N030 0 0 NPN
R66 Hebbian N021 35K
R67 N021 N025 15K
R68 0 N021 15K
XU16 0 N021 +10 -10 Hebbian level.2 Avol=1Meg GBW=10Meg Slew=10Meg ilimit=25m rail=0 Vos=0 phimargin=45 en=0 enk=0 in=0 ink=0 Rin=500Meg  ; pins IN+ IN- V+ V- OUT
C13 Hebbian N021 0.047µ
R69 N030 Sine 1K
V9 Tpre2 0 PULSE(0 3 50m 1n 1n 3m 10m)
V10 Tpre1 0 PULSE(0 3 10m 1n 1n 3m 10.2m)
R70 N028 N029 100K
V11 +10 0 5
V12 0 -10 5
D1 0 N051 1N4148
D6 P001 N064 1N4148
XU20 PWM_OUT N067 +5 -5 N068 level.2 Avol=1Meg GBW=10Meg Slew=10Meg ilimit=25m rail=0 Vos=0 phimargin=45 en=0 enk=0 in=0 ink=0 Rin=5000Meg  ; pins IN+ IN- V+ V- OUT
C14 N009 N006 1µ
R73 +5 N009 10K
R74 +5 N007 10K
Q2 N007 N009 0 0 2N2222
C15 N008 N007 0.1µ
D14 0 N008 RF05VA1S
XU21 N005 N006 +10 -10 N006 level.2 Avol=1Meg GBW=10Meg Slew=10Meg ilimit=25m rail=0 Vos=0 phimargin=45 en=0 enk=0 in=0 ink=0 Rin=500Meg  ; pins IN+ IN- V+ V- OUT
XU22 N008 N003 +5 -5 N003 level.2 Avol=1Meg GBW=10Meg Slew=10Meg ilimit=25m rail=0 Vos=0 phimargin=45 en=0 enk=0 in=0 ink=0 Rin=500Meg  ; pins IN+ IN- V+ V- OUT
C16 N018 N014 1µ
R75 -5 N018 10K
R76 -5 N015 10K
C17 N016 N015 0.1µ
D15 N016 0 RF05VA1S
XU23 N016 N013 +5 -5 N013 level.2 Avol=1Meg GBW=10Meg Slew=10Meg ilimit=25m rail=0 Vos=0 phimargin=45 en=0 enk=0 in=0 ink=0 Rin=500Meg  ; pins IN+ IN- V+ V- OUT
Q3 0 N018 N015 0 BC858B
XU24 N019 N014 +10 -10 N014 level.2 Avol=1Meg GBW=10Meg Slew=10Meg ilimit=25m rail=0 Vos=0 phimargin=45 en=0 enk=0 in=0 ink=0 Rin=500Meg  ; pins IN+ IN- V+ V- OUT
XU25 0 N001 +5 -5 N002 level.2 Avol=1Meg GBW=10Meg Slew=10Meg ilimit=25m rail=0 Vos=0 phimargin=45 en=0 enk=0 in=0 ink=0 Rin=500Meg  ; pins IN+ IN- V+ V- OUT
R77 N002 N001 13K
R78 N001 N003 100K
XU26 0 N011 +5 -5 N012 level.2 Avol=1Meg GBW=10Meg Slew=10Meg ilimit=25m rail=0 Vos=0 phimargin=45 en=0 enk=0 in=0 ink=0 Rin=500Meg  ; pins IN+ IN- V+ V- OUT
R79 N012 N011 13K
R80 N011 N013 180K
XU27 0 N010 +5 -5 PWM_OUT level.2 Avol=1Meg GBW=10Meg Slew=10Meg ilimit=25m rail=0 Vos=0 phimargin=45 en=0 enk=0 in=0 ink=0 Rin=500Meg  ; pins IN+ IN- V+ V- OUT
R82 N010 N002 100K
R83 N010 N012 100K
R84 PWM_OUT N010 100K
D16 N004 N005 RF05VA1S
D17 N017 Hebbian RF05VA1S
R85 0 N005 100K
R86 N019 0 100K
D18 N019 N017 RF05VA1S
D19 Hebbian N004 RF05VA1S
R81 P007 N010 100K
V7 P007 0 -0.15
R13 N067 0 2.7Meg
XU28 N058 N044 +5 -5 NC_01 level.2 Avol=1Meg GBW=10Meg Slew=10Meg ilimit=25m rail=0 Vos=0 phimargin=45 en=0 enk=0 in=0 ink=0 Rin=500Meg  ; pins IN+ IN- V+ V- OUT
V3 vres 0
XU19 0 N043 +5 -5 log_pulse level.2 Avol=1Meg GBW=10Meg Slew=10Meg ilimit=25m rail=0 Vos=0 phimargin=45 en=0 enk=0 in=0 ink=0 Rin=500Meg  ; pins IN+ IN- V+ V- OUT
R14 N043 Tpre1 1Meg
XU29 0 N069 +5 -5 log_level level.2 Avol=1Meg GBW=10Meg Slew=10Meg ilimit=25m rail=0 Vos=0 phimargin=45 en=0 enk=0 in=0 ink=0 Rin=500Meg  ; pins IN+ IN- V+ V- OUT
R91 N069 N068 1Meg
XU30 0 N046 +5 -5 sum level.2 Avol=1Meg GBW=10Meg Slew=10Meg ilimit=25m rail=0 Vos=0 phimargin=45 en=0 enk=0 in=0 ink=0 Rin=500Meg  ; pins IN+ IN- V+ V- OUT
R92 N046 log_level 100K
R93 N046 log_pulse 100K
R94 sum N046 100K
R95 inv_out N049 1000
XU31 0 N049 +5 -5 inv_out level.2 Avol=1Meg GBW=10Meg Slew=10Meg ilimit=25m rail=0 Vos=0 phimargin=45 en=0 enk=0 in=0 ink=0 Rin=500Meg  ; pins IN+ IN- V+ V- OUT
D4 N069 log_level 1N4148
D20 N043 log_pulse 1N4148
D21 sum N049 1N4148
R96 out N050 100K
XU32 0 N050 +5 -5 out level.2 Avol=1Meg GBW=10Meg Slew=10Meg ilimit=25m rail=0 Vos=0 phimargin=45 en=0 enk=0 in=0 ink=0 Rin=500Meg  ; pins IN+ IN- V+ V- OUT
R97 N050 inv_out 100K
R20 N058 P008 10K
R71 0 N058 20K
D22 N057 P008 1N4148
R19 membr out 20K
R18 membr Tpre2 43K
.model D D
.lib standard.dio
.model NPN NPN
.model PNP PNP
.lib standard.bjt
.tran 0 8 0 10000u
.lib UniversalOpamps2.sub
.backanno
.end